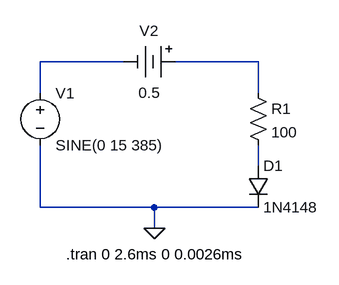
[diagram p0: schematic Clipper2.asc]
Clipper2.asc, the LTspice schematic file:
Version 4
SHEET 1 880 680
WIRE 144 80 16 80
WIRE 352 80 224 80
WIRE 16 128 16 80
WIRE 352 128 352 80
WIRE 352 240 352 208
WIRE 16 304 16 208
WIRE 192 304 16 304
WIRE 352 304 192 304
WIRE 192 336 192 304
FLAG 192 336 0
SYMBOL voltage 16 112 R0
WINDOW 123 0 0 Left 0
WINDOW 39 0 0 Left 0
SYMATTR InstName V1
SYMATTR Value SINE(0 15 385)
SYMBOL Misc\\battery 240 80 R90
WINDOW 0 -32 56 VBottom 2
WINDOW 3 32 56 VTop 2
SYMATTR InstName V2
SYMATTR Value 0.5
SYMBOL res 336 112 R0
SYMATTR InstName R1
SYMATTR Value 100
SYMBOL diode 336 240 R0
SYMATTR InstName D1
SYMATTR Value 1N4148
TEXT 56 376 Left 2 !.tran 0 2.6ms 0 0.0026ms

The netlist it stands for:
* Clipper2.asc
V1 N001 0 SINE(0 15 385)
V2 N002 N001 0.5
R1 N002 N003 100
D1 N003 0 1N4148
.model D D
.lib standard.dio
.tran 0 2.6ms 0 0.0026ms
.backanno
.end